# Altium schematic sheet can.SchDoc
size B
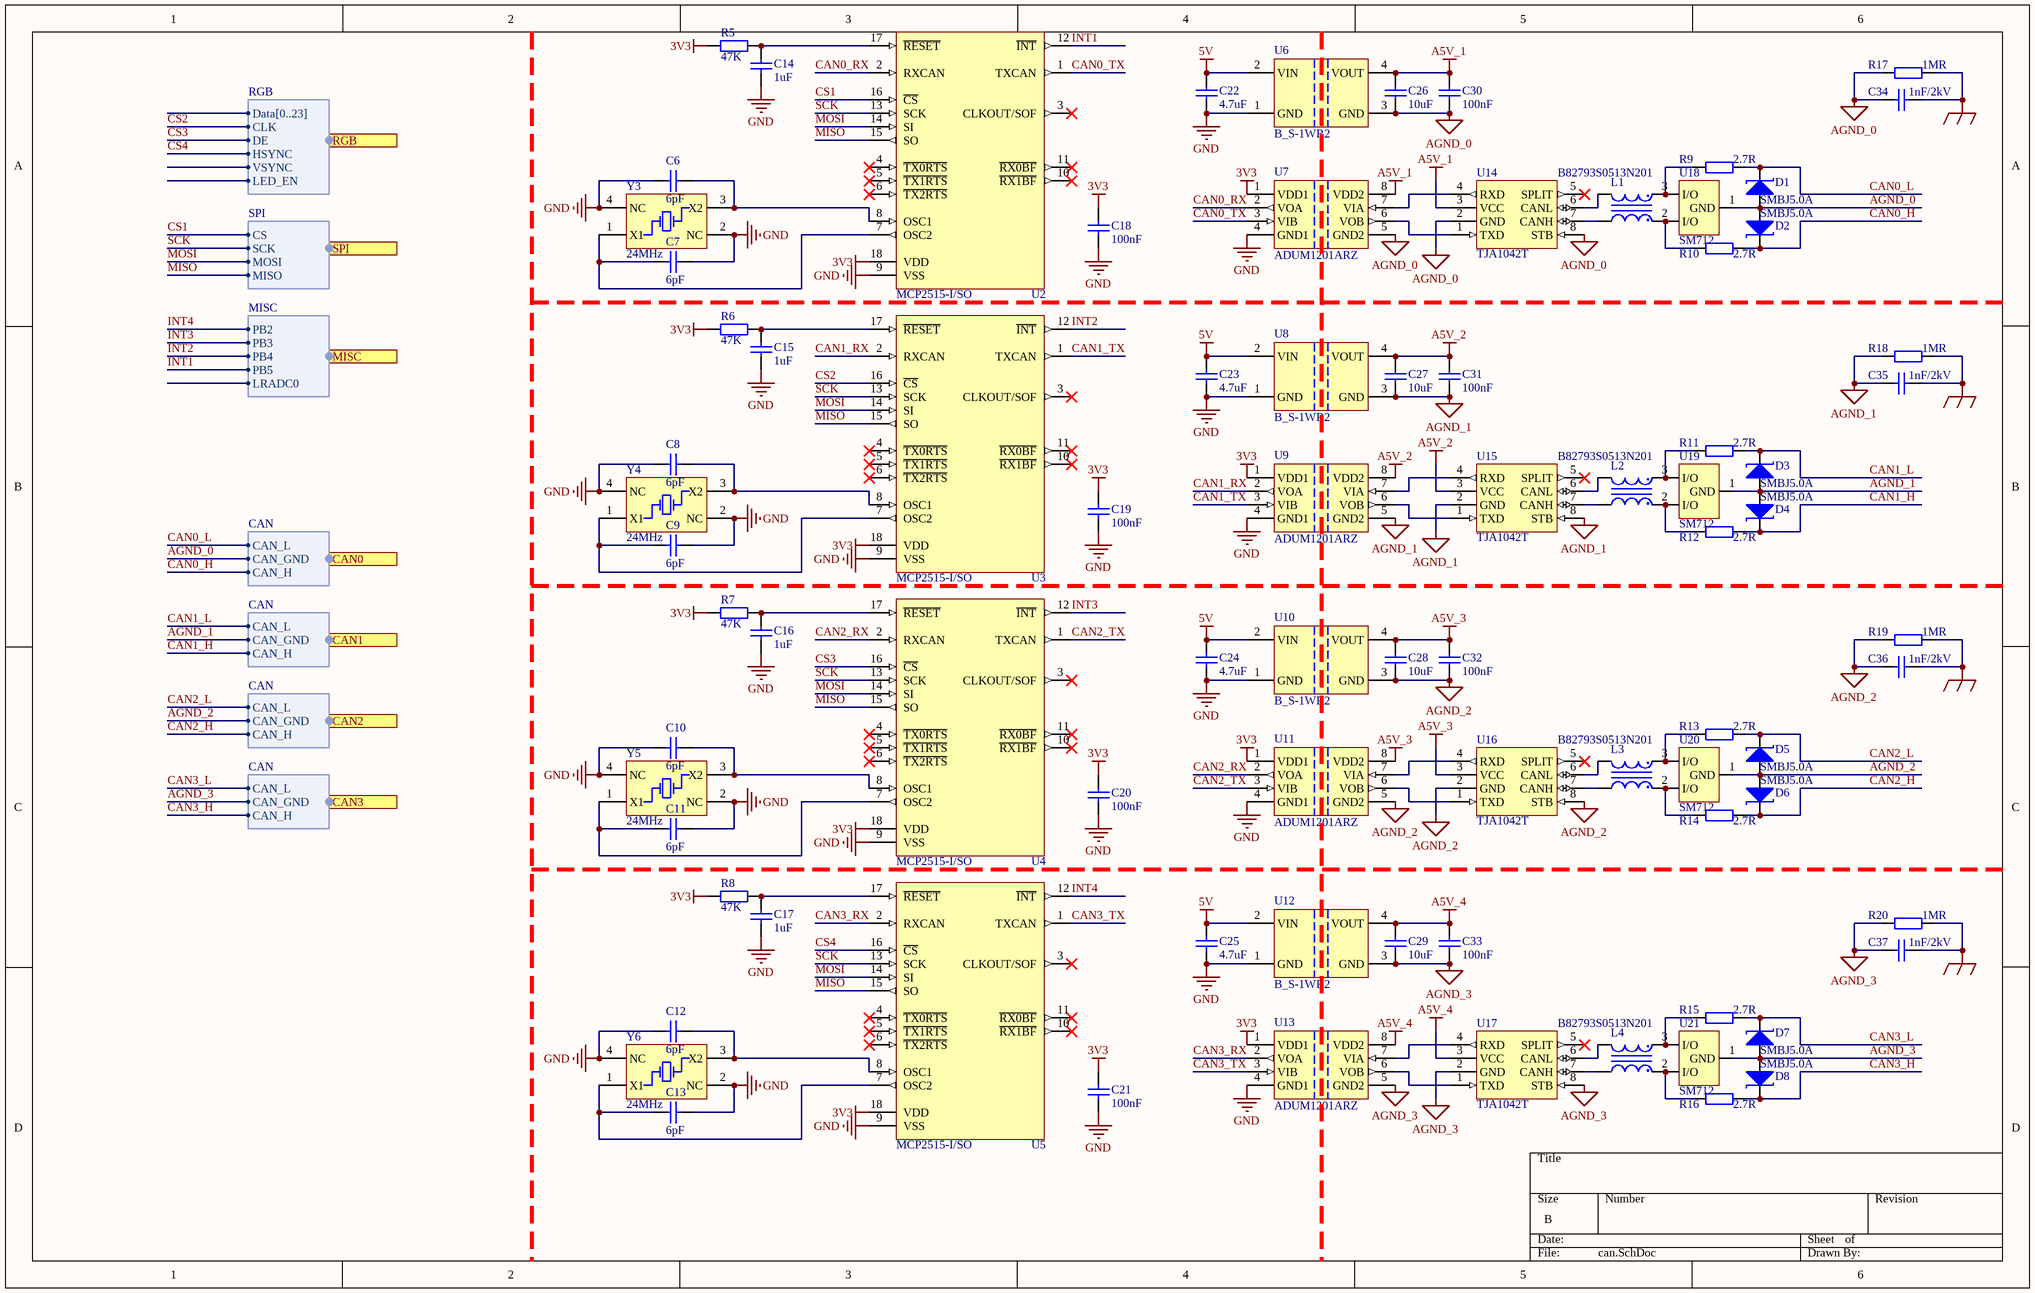
[diagram p0: can.SchDoc]

## Parts
C6  6pF  [CAPC1608L]
C7  6pF  [CAPC1608L]
C8  6pF  [CAPC1608L]
C9  6pF  [CAPC1608L]
C10  6pF  [CAPC1608L]
C11  6pF  [CAPC1608L]
C12  6pF  [CAPC1608L]
C13  6pF  [CAPC1608L]
C14  1uF  [CAPC1608L]
C15  1uF  [CAPC1608L]
C16  1uF  [CAPC1608L]
C17  1uF  [CAPC1608L]
C18  100nF  [CAPC1608L]
C19  100nF  [CAPC1608L]
C20  100nF  [CAPC1608L]
C21  100nF  [CAPC1608L]
C22  4.7uF  [CAPC2012L]
C23  4.7uF  [CAPC2012L]
C24  4.7uF  [CAPC2012L]
C25  4.7uF  [CAPC2012L]
C26  10uF  [CAPC2012L]
C27  10uF  [CAPC2012L]
C28  10uF  [CAPC2012L]
C29  10uF  [CAPC2012L]
C30  100nF  [CAPC1608L]
C31  100nF  [CAPC1608L]
C32  100nF  [CAPC1608L]
C33  100nF  [CAPC1608L]
C34  1nF/2kV  [CAPC3216L]
C35  1nF/2kV  [CAPC3216L]
C36  1nF/2kV  [CAPC3216L]
C37  1nF/2kV  [CAPC3216L]
D1  SMBJ5.0A  [DO-214AA]
D2  SMBJ5.0A  [DO-214AA]
D3  SMBJ5.0A  [DO-214AA]
D4  SMBJ5.0A  [DO-214AA]
D5  SMBJ5.0A  [DO-214AA]
D6  SMBJ5.0A  [DO-214AA]
D7  SMBJ5.0A  [DO-214AA]
D8  SMBJ5.0A  [DO-214AA]
L1  B82793S0513N201  [IND0163-B]
L2  B82793S0513N201  [IND0163-B]
L3  B82793S0513N201  [IND0163-B]
L4  B82793S0513N201  [IND0163-B]
R5  47K  [RESC1608L]
R6  47K  [RESC1608L]
R7  47K  [RESC1608L]
R8  47K  [RESC1608L]
R9  2.7R  [RESC3216L]
R10  2.7R  [RESC3216L]
R11  2.7R  [RESC3216L]
R12  2.7R  [RESC3216L]
R13  2.7R  [RESC3216L]
R14  2.7R  [RESC3216L]
R15  2.7R  [RESC3216L]
R16  2.7R  [RESC3216L]
R17  1MR  [RESC3216L]
R18  1MR  [RESC3216L]
R19  1MR  [RESC3216L]
R20  1MR  [RESC3216L]
U2  MCP2515-I/SO  [SOIC18_N]
U3  MCP2515-I/SO  [SOIC18_N]
U4  MCP2515-I/SO  [SOIC18_N]
U5  MCP2515-I/SO  [SOIC18_N]
U6  B_S-1WR2  [B_S-1WR2]
U7  ADUM1201ARZ  [SOIC8_L]
U8  B_S-1WR2  [B_S-1WR2]
U9  ADUM1201ARZ  [SOIC8_L]
U10  B_S-1WR2  [B_S-1WR2]
U11  ADUM1201ARZ  [SOIC8_L]
U12  B_S-1WR2  [B_S-1WR2]
U13  ADUM1201ARZ  [SOIC8_L]
U14  TJA1042T  [SOIC8_L]
U15  TJA1042T  [SOIC8_L]
U16  TJA1042T  [SOIC8_L]
U17  TJA1042T  [SOIC8_L]
U18  SM712  [SOT23_L]
U19  SM712  [SOT23_L]
U20  SM712  [SOT23_L]
U21  SM712  [SOT23_L]
Y3  24MHz  [XTAL-3225]
Y4  24MHz  [XTAL-3225]
Y5  24MHz  [XTAL-3225]
Y6  24MHz  [XTAL-3225]

## Ports
CAN0 (harness CAN), CAN1 (harness CAN), CAN2 (harness CAN), CAN3 (harness CAN), MISC (harness MISC), RGB (harness RGB), SPI (harness SPI)

## Harnesses
SPI: CS, SCK, MOSI, MISO
MISC: PB2, PB3, PB4, PB5, LRADC0
RGB: Data[0..23], CLK, DE, HSYNC, VSYNC, LED_EN
CAN: CAN_L, CAN_GND, CAN_H

## Nets
3V3: C18.2 C19.2 C20.2 C21.2 R5.1 R6.1 R7.1 R8.1 U2.18(VDD) U3.18(VDD) U4.18(VDD) U5.18(VDD) U7.1(VDD1) U9.1(VDD1) U11.1(VDD1) U13.1(VDD1)
5V: C22.2 C23.2 C24.2 C25.2 U6.2(VIN) U8.2(VIN) U10.2(VIN) U12.2(VIN)
A5V_1: C26.2 C30.1 U6.4(VOUT) U7.8(VDD2) U14.3(VCC)
A5V_2: C27.2 C31.1 U8.4(VOUT) U9.8(VDD2) U15.3(VCC)
A5V_3: C28.2 C32.1 U10.4(VOUT) U11.8(VDD2) U16.3(VCC)
A5V_4: C29.2 C33.1 U12.4(VOUT) U13.8(VDD2) U17.3(VCC)
AGND_0: C26.1 C30.2 C34.1 D1.1(A) D2.1(A) R17.2 U6.3(GND) U7.5(GND2) U14.2(GND) U14.8(STB) U18.1(GND) ; port CAN0.CAN_GND
AGND_1: C27.1 C31.2 C35.1 D3.1(A) D4.1(A) R18.2 U8.3(GND) U9.5(GND2) U15.2(GND) U15.8(STB) U19.1(GND) ; port CAN1.CAN_GND
AGND_2: C28.1 C32.2 C36.1 D5.1(A) D6.1(A) R19.2 U10.3(GND) U11.5(GND2) U16.2(GND) U16.8(STB) U20.1(GND) ; port CAN2.CAN_GND
AGND_3: C29.1 C33.2 C37.1 D7.1(A) D8.1(A) R20.2 U12.3(GND) U13.5(GND2) U17.2(GND) U17.8(STB) U21.1(GND) ; port CAN3.CAN_GND
EARTH: C34.2 C35.2 C36.2 C37.2 R17.1 R18.1 R19.1 R20.1
GND: C6.1 C7.2 C8.1 C9.2 C10.1 C11.2 C12.1 C13.2 C14.1 C15.1 C16.1 C17.1 C18.1 C19.1 C20.1 C21.1 C22.1 C23.1 C24.1 C25.1 U2.9(VSS) U3.9(VSS) U4.9(VSS) U5.9(VSS) U6.1(GND) U7.4(GND1) U8.1(GND) U9.4(GND1) U10.1(GND) U11.4(GND1) U12.1(GND) U13.4(GND1) Y3.2(NC) Y3.4(NC) Y4.2(NC) Y4.4(NC) Y5.2(NC) Y5.4(NC) Y6.2(NC) Y6.4(NC)
CAN0_H: D2.2(K) R10.1 ; port CAN0.CAN_H
CAN0_L: D1.2(K) R9.1 ; port CAN0.CAN_L
CAN0_RX: U2.2(RXCAN) U7.2(VOA)
CAN0_TX: U2.1(TXCAN) U7.3(VIB)
CAN1_H: D4.2(K) R12.1 ; port CAN1.CAN_H
CAN1_L: D3.2(K) R11.1 ; port CAN1.CAN_L
CAN1_RX: U3.2(RXCAN) U9.2(VOA)
CAN1_TX: U3.1(TXCAN) U9.3(VIB)
CAN2_H: D6.2(K) R14.1 ; port CAN2.CAN_H
CAN2_L: D5.2(K) R13.1 ; port CAN2.CAN_L
CAN2_RX: U4.2(RXCAN) U11.2(VOA)
CAN2_TX: U4.1(TXCAN) U11.3(VIB)
CAN3_H: D8.2(K) R16.1 ; port CAN3.CAN_H
CAN3_L: D7.2(K) R15.1 ; port CAN3.CAN_L
CAN3_RX: U5.2(RXCAN) U13.2(VOA)
CAN3_TX: U5.1(TXCAN) U13.3(VIB)
CS1: U2.16(~{CS}) ; port SPI.CS
CS2: U3.16(~{CS}) ; port RGB.CLK
CS3: U4.16(~{CS}) ; port RGB.DE
CS4: U5.16(~{CS}) ; port RGB.HSYNC
INT1: U2.12(~{INT}) ; port MISC.PB5
INT2: U3.12(~{INT}) ; port MISC.PB4
INT3: U4.12(~{INT}) ; port MISC.PB3
INT4: U5.12(~{INT}) ; port MISC.PB2
MISO: U2.15(SO) U3.15(SO) U4.15(SO) U5.15(SO) ; port SPI.MISO
MOSI: U2.14(SI) U3.14(SI) U4.14(SI) U5.14(SI) ; port SPI.MOSI
SCK: U2.13(SCK) U3.13(SCK) U4.13(SCK) U5.13(SCK) ; port SPI.SCK
NetC6_2: C6.2 U2.8(OSC1) Y3.3(X2)
NetC7_1: C7.1 U2.7(OSC2) Y3.1(X1)
NetC8_2: C8.2 U3.8(OSC1) Y4.3(X2)
NetC9_1: C9.1 U3.7(OSC2) Y4.1(X1)
NetC10_2: C10.2 U4.8(OSC1) Y5.3(X2)
NetC11_1: C11.1 U4.7(OSC2) Y5.1(X1)
NetC12_2: C12.2 U5.8(OSC1) Y6.3(X2)
NetC13_1: C13.1 U5.7(OSC2) Y6.1(X1)
NetC14_2: C14.2 R5.2 U2.17(~{RESET})
NetC15_2: C15.2 R6.2 U3.17(~{RESET})
NetC16_2: C16.2 R7.2 U4.17(~{RESET})
NetC17_2: C17.2 R8.2 U5.17(~{RESET})
NetL1_1: L1.1 R10.2 U18.2(I/O)
NetL1_2: L1.2 U14.7(CANH)
NetL1_3: L1.3 U14.6(CANL)
NetL1_4: L1.4 R9.2 U18.3(I/O)
NetL2_1: L2.1 R12.2 U19.2(I/O)
NetL2_2: L2.2 U15.7(CANH)
NetL2_3: L2.3 U15.6(CANL)
NetL2_4: L2.4 R11.2 U19.3(I/O)
NetL3_1: L3.1 R14.2 U20.2(I/O)
NetL3_2: L3.2 U16.7(CANH)
NetL3_3: L3.3 U16.6(CANL)
NetL3_4: L3.4 R13.2 U20.3(I/O)
NetL4_1: L4.1 R16.2 U21.2(I/O)
NetL4_2: L4.2 U17.7(CANH)
NetL4_3: L4.3 U17.6(CANL)
NetL4_4: L4.4 R15.2 U21.3(I/O)
NetU7_6: U7.6(VOB) U14.1(TXD)
NetU7_7: U7.7(VIA) U14.4(RXD)
NetU9_6: U9.6(VOB) U15.1(TXD)
NetU9_7: U9.7(VIA) U15.4(RXD)
NetU11_6: U11.6(VOB) U16.1(TXD)
NetU11_7: U11.7(VIA) U16.4(RXD)
NetU13_6: U13.6(VOB) U17.1(TXD)
NetU13_7: U13.7(VIA) U17.4(RXD)

Not connected (* = marked no-connect by the designer): U2 3(CLKOUT/SOF)* 4(~{TX0RTS})* 5(~{TX1RTS})* 6(~{TX2RTS})* 10(~{RX1BF})* 11(~{RX0BF})*; U3 3(CLKOUT/SOF)* 4(~{TX0RTS})* 5(~{TX1RTS})* 6(~{TX2RTS})* 10(~{RX1BF})* 11(~{RX0BF})*; U4 3(CLKOUT/SOF)* 4(~{TX0RTS})* 5(~{TX1RTS})* 6(~{TX2RTS})* 10(~{RX1BF})* 11(~{RX0BF})*; U5 3(CLKOUT/SOF)* 4(~{TX0RTS})* 5(~{TX1RTS})* 6(~{TX2RTS})* 10(~{RX1BF})* 11(~{RX0BF})*; U14 5(SPLIT)*; U15 5(SPLIT)*; U16 5(SPLIT)*; U17 5(SPLIT)*

## Library data of the parts
C6-C37 = Cap1: Capacitor; Published: 8-Jun-2000; LatestRevisionDate: 17-Jul-2002; LatestRevisionNote: Re-released for DXP Platform.; PackageReference: RAD-0.3; Publisher: Altium Limited
  C6-C13: Value: 6pF
  C14-C17: Value: 1uF
  C18-C21 C30-C33: Value: 100nF
  C22-C25: Value: 4.7uF
  C26-C29: Value: 10uF
  C34-C37: Value: 1nF/2kV
D1-D8 = Tranzorb1: Transient Voltage Suppression (TVS) Diode; Published: 24-Mar-1999; LatestRevisionDate: 17-Jul-2002; LatestRevisionNote: Re-released for DXP Platform.; PackageReference: DO-7; Publisher: Altium Limited; PackageDescription: Axial Lead Diode
L1-L4 = Inductor1: 共模电感; Code_IEC: 1005; Published: 8-Jun-2000; LatestRevisionDate: 29-May-2009; LatestRevisionNote: IPC-7351 Footprint Added.; PackageReference: 0402-A; Publisher: Altium Limited; PackageDescription: Chip Inductor; Code_JEITA: 0402; Value: B82793S0513N201
R5-R20 = Res1: Resistor; Published: 8-Jun-2000; LatestRevisionDate: 17-Jul-2002; LatestRevisionNote: Re-released for DXP Platform.; PackageReference: AXIAL-0.4; Publisher: Altium Limited
  R5-R8: Value: 47K
  R9-R16: Value: 2.7R
  R17-R20: Value: 1MR
U2-U5 = MCP2515-I/SO: Stand-Alone CAN Controller With SPI Interface, 18-Pin SOIC, Industrial Temperature; Published: 29-Jan-2009; DatasheetVersion: revE, Nov-2007; PackageVersion: revBB, Aug-2009; PackageReference: SOIC-SO18; Publisher: Altium Limited; PackageDescription: 18-Lead Plastic Small Outline (SO) - Wide 7.50mm Body [SOIC]; Supplier 1: Digi-Key; Supplier Part Number 1: MCP2515-I/SO-ND; Supplier 2: Farnell; Supplier Part Number 2: 1292239; Code_JEDEC: MS-013; ComponentLink1Description: Datasheet; ComponentLink1URL: http://ww1.microchip.com/downloads/en/DeviceDoc/21801e.pdf; ComponentLink2Description: Packaging Specification; ComponentLink2URL: http://www.microchip.com/stellent/groups/techpub_sg/documents/packagingspec/en012702.pdf; ComponentLink3Description: Microchip.com Home; ComponentLink3URL: http://www.microchip.com/
U6 U8 U10 U12 = B_S-1WR2: DC/DC 模块电源 1W，定电压输入，隔离非稳压单路输出
U7 U9 U11 U13 = ADUM1201: 双通道数字隔离器（1/1通道方向性）
U14-U17 = TJA1042T: 具有待机模式的高速CAN收发器
U18-U21 = Tranzorb2
Y3-Y6 = XTAL_PASSIVE_4: Crystal Oscillator; Published: 8-Jun-2000; LatestRevisionDate: 17-Jul-2002; LatestRevisionNote: Re-released for DXP Platform.; PackageReference: R38; Publisher: Altium Limited; PackageDescription: Crystal, Thru-Hole; 2 Leads; Body 3.1 x 8.2 mm (Dia.xH)